# Altium schematic sheet Robot_Э3.SchDoc: Наименование
size 840 x 594 mm; SheetNumber: 1; SheetTotal: 1; PageSetup: Record=PageOptions|CenterHorizontal=True|CenterVertical=True|PrintScale=0.94|XCorrection=1.00|YCorrection=1.00|PrintKind=1|BorderSize=5000000|LeftOffset=0|BottomOffset=0|Orientation=1|PaperLength=1000|PaperWidth=1000|Scale=100|PaperSource=7|PrintQuality=-4|MediaType=1|DitherType=10|PaperKind=A4|PrintScaleMode=1; HeadOfSector: Нач. сектора; Name: Наименование; Type: Схема электрическая принципиальная; ListNumber: 1; DocumentName: Sheet1.SCHDOC
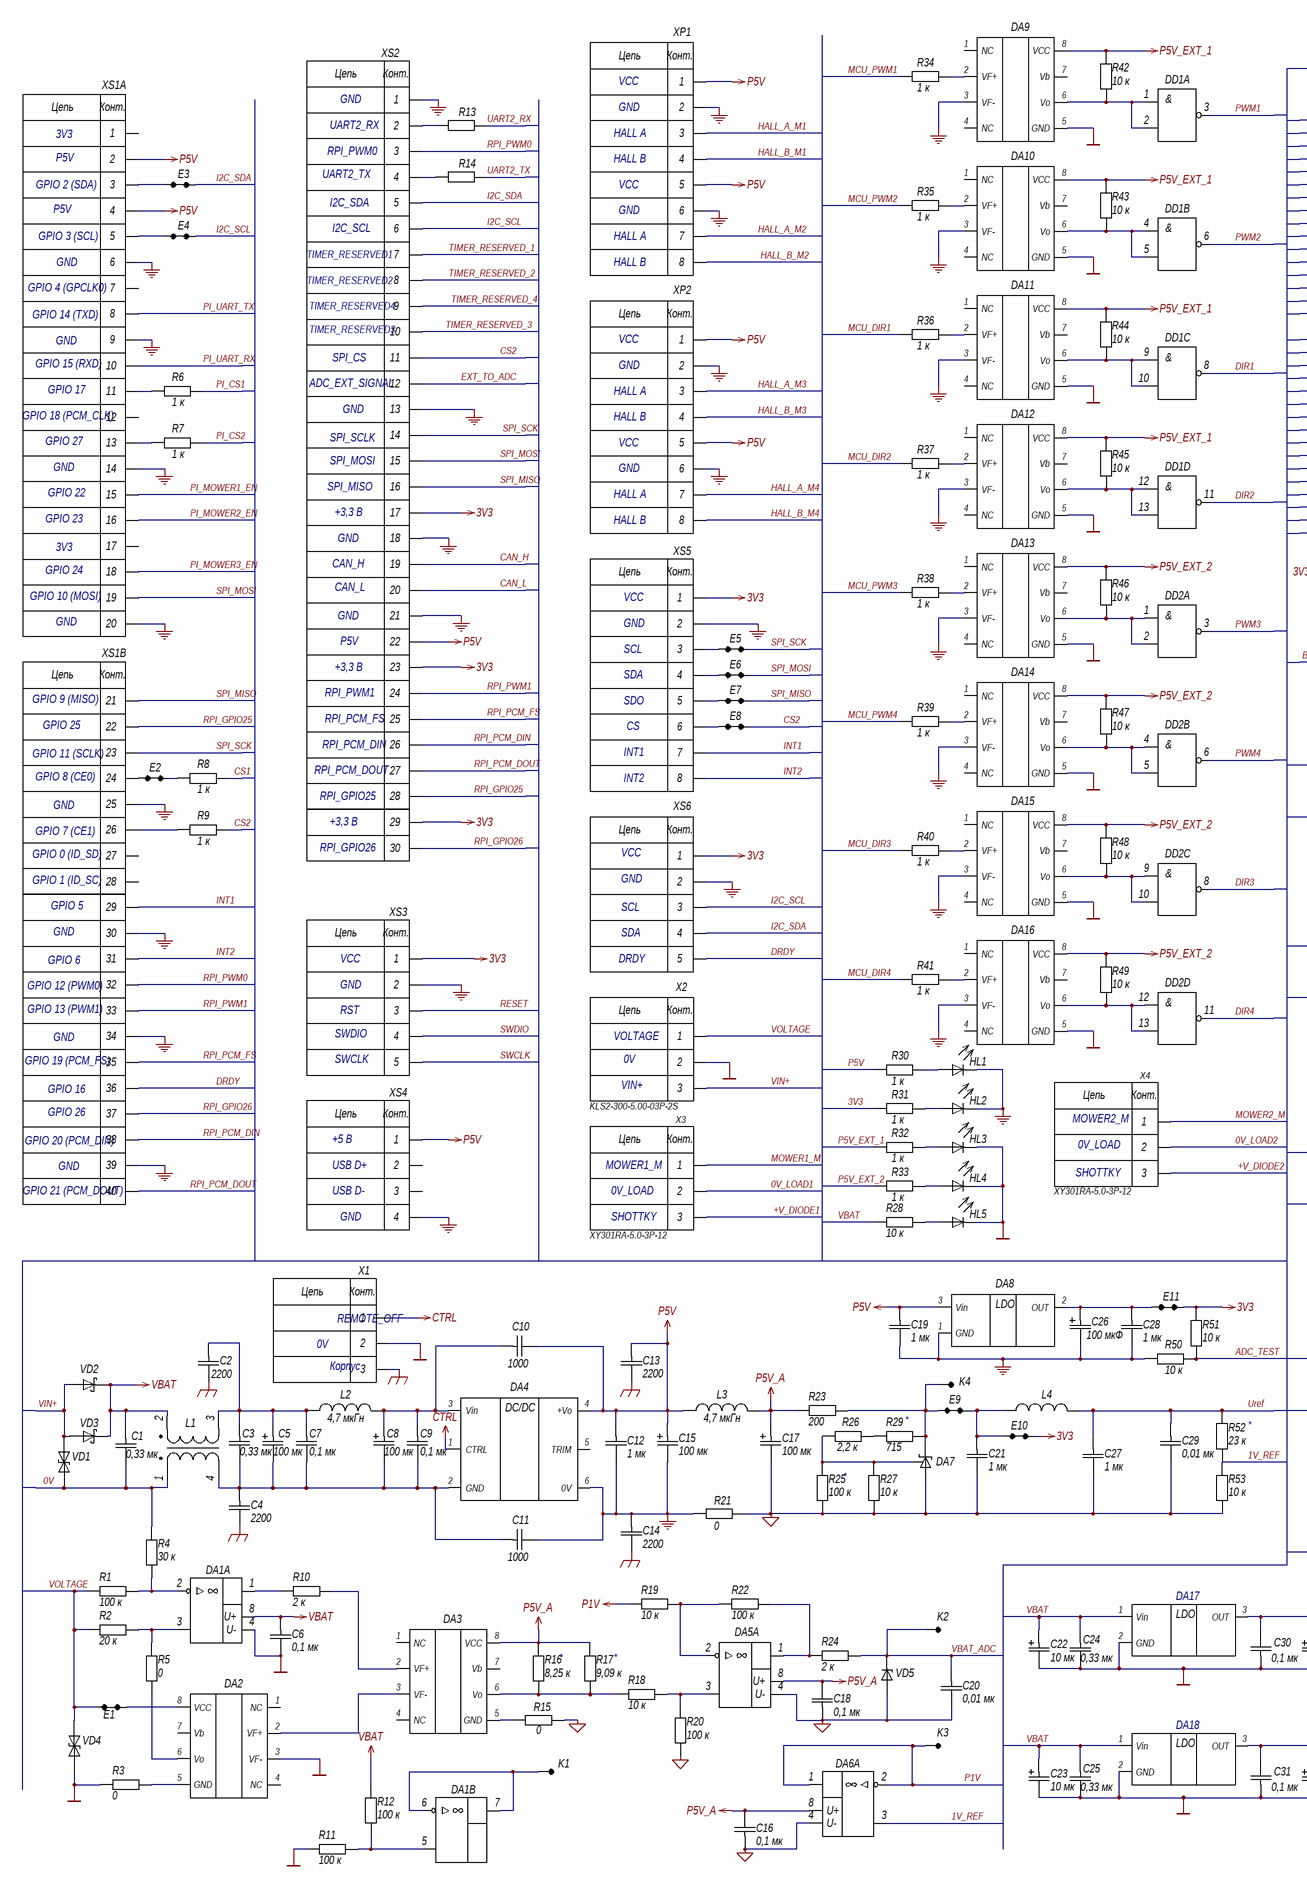
[diagram p0: Robot_Э3.SchDoc, left]
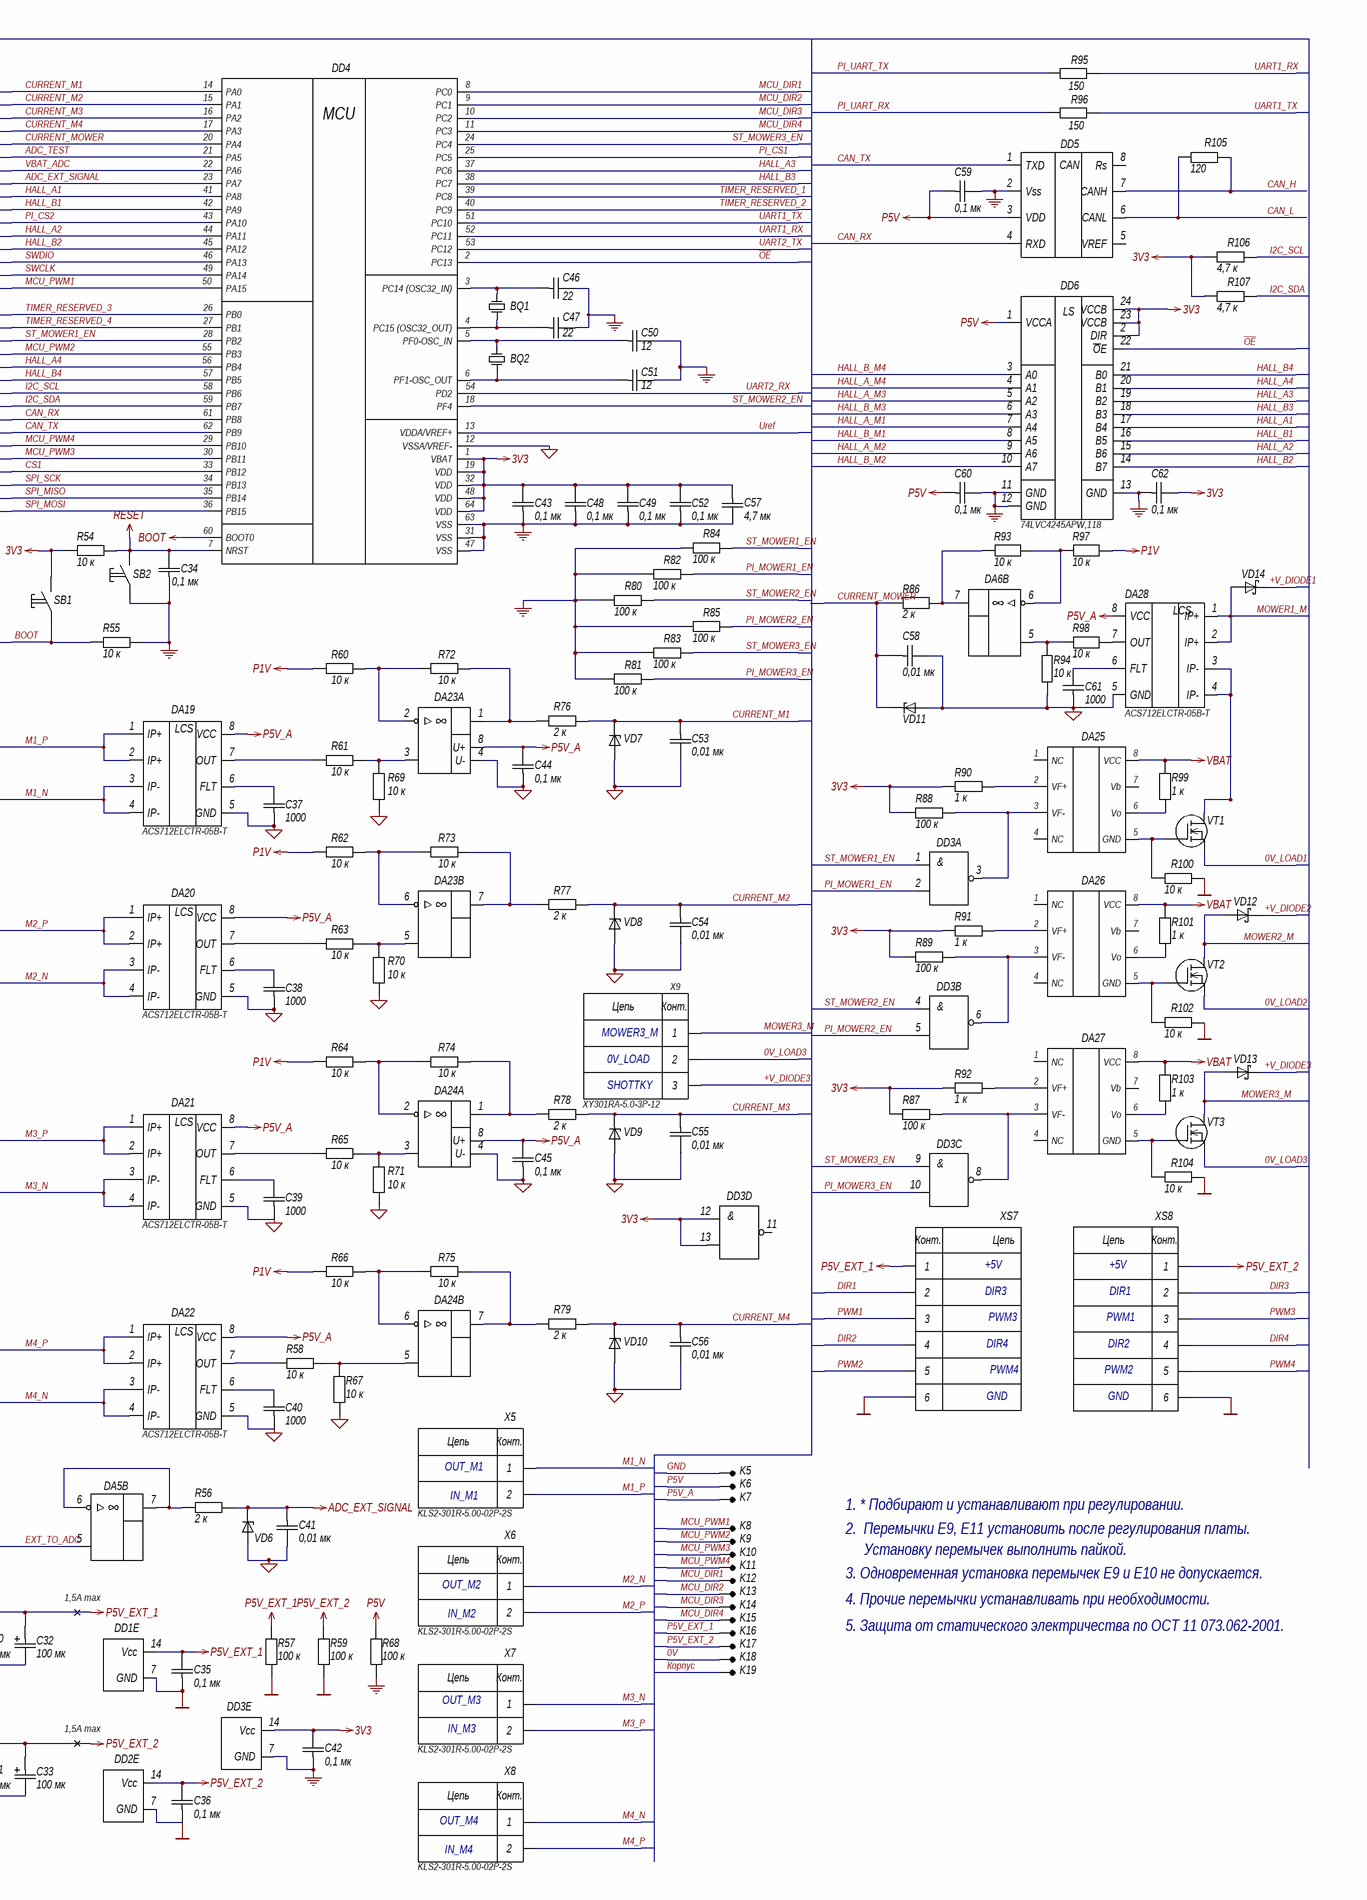
[diagram p1: Robot_Э3.SchDoc, right]

## Parts
BQ1  (no value)  [HC-49S]
BQ2  (no value)  [32768SMD]
C1  0,33 мк  [C1206]
C2  2200  [C1206]
C3  0,33 мк  [C1206]
C4  2200  [C1206]
C5  100 мк  [Capacitor10x20]
C6  0,1 мк  [C1206]
C7  0,1 мк  [C1206]
C8  100 мк  [Capacitor10x20]
C9  0,1 мк  [C1206]
C10  1000  [R1206]
C11  1000  [R1206]
C12  1 мк  [C0805]
C13  2200  [C1206]
C14  2200  [C1206]
C15  100 мк  [Case C]
C16  0,1 мк  [C1206]
C17  100 мк  [Case C]
C18  0,1 мк  [C1206]
C19  1 мк  [C0805]
C20  0,01 мк  [C0603]
C21  1 мк  [C0805]
C22  10 мк  [Case C]
C23  10 мк  [Case C]
C24  0,33 мк  [C1206]
C25  0,33 мк  [C1206]
C26  100 мкФ  [Case C]
C27  1 мк  [C0805]
C28  1 мк  [C0805]
C29  0,01 мк  [C0603]
C30  0,1 мк  [C1206]
C31  0,1 мк  [C1206]
C32  100 мк  [Case C]
C33  100 мк  [Case C]
C34  0,1 мк  [C1206]
C35  0,1 мк  [C1206]
C36  0,1 мк  [C1206]
C37  1000  [C1206]
C38  1000  [C1206]
C39  1000  [C1206]
C40  1000  [C1206]
C41  0,01 мк  [C0603]
C42  0,1 мк  [C1206]
C43  0,1 мк  [C1206]
C44  0,1 мк  [C1206]
C45  0,1 мк  [C1206]
C46  22  [C0603]
C47  22  [C0603]
C48  0,1 мк  [C1206]
C49  0,1 мк  [C1206]
C50  12  [C0603]
C51  12  [C0603]
C52  0,1 мк  [C1206]
C53  0,01 мк  [C0603]
C54  0,01 мк  [C0603]
C55  0,01 мк  [C0603]
C56  0,01 мк  [C0603]
C57  4,7 мк  [C1206]
C58  0,01 мк  [C0603]
C59  0,1 мк  [C1206]
C60  0,1 мк  [C1206]
C61  1000  [C1206]
C62  0,1 мк  [C1206]
DA1  LM358ADR  [SOIC-8]  (value not drawn)  (parts A,B of 2)
DA2  6N136  [6N136]  (value not drawn)
DA3  6N136  [6N136]  (value not drawn)
DA4  Part Number  [URB_LD-20WR3]  (value not drawn)
DA5  OPA-2-8p  [SOIC-8]  (value not drawn)  (parts A,B of 2)
DA6  OPA-2-8p  [SOIC-8]  (value not drawn)  (parts A,B of 2)
DA7  (no value)  [SOT-23-3]
DA8  (no value)  [SOT-223-3]
DA9  6N136  [6N136]  (value not drawn)
DA10  6N136  [6N136]  (value not drawn)
DA11  6N136  [6N136]  (value not drawn)
DA12  6N136  [6N136]  (value not drawn)
DA13  6N136  [6N136]  (value not drawn)
DA14  6N136  [6N136]  (value not drawn)
DA15  6N136  [6N136]  (value not drawn)
DA16  6N136  [6N136]  (value not drawn)
DA17  (no value)  [D2PAK(TO-263)]
DA18  (no value)  [D2PAK(TO-263)]
DA19  ACS712ELCTR-05B-T  [SOIC-8]
DA20  ACS712ELCTR-05B-T  [SOIC-8]
DA21  ACS712ELCTR-05B-T  [SOIC-8]
DA22  ACS712ELCTR-05B-T  [SOIC-8]
DA23  OPA-2-8p  [SOIC-8]  (value not drawn)  (parts A,B of 2)
DA24  OPA-2-8p  [SOIC-8]  (value not drawn)  (parts A,B of 2)
DA25  6N136  [6N136]  (value not drawn)
DA26  6N136  [6N136]  (value not drawn)
DA27  6N136  [6N136]  (value not drawn)
DA28  ACS712ELCTR-05B-T  [SOIC-8]
DD1  (no value)  [SOIC-14]  (parts A,B,C,D,E of 5)
DD2  (no value)  [SOIC-14]  (parts A,B,C,D,E of 5)
DD3  (no value)  [SOIC-14]  (parts A,B,C,D,E of 5)
DD4  Микроконтроллер  [TI TQFP-64 PAG0064A]  (value not drawn)
DD5  MCP2551  [SOIC-8]  (value not drawn)
DD6  74LVC4245APW,118  [TSSOP-24]
E1  (no value)  [E2]
E2  (no value)  [E2]
E3  (no value)  [E2]
E4  (no value)  [E2]
E5  (no value)  [E2]
E6  (no value)  [E2]
E7  (no value)  [E2]
E8  (no value)  [E2]
E9  (no value)  [E2]
E10  (no value)  [E2]
E11  (no value)  [E2]
HL1  KP-2012SURCK  [LED0805]  (value not drawn)
HL2  KP-2012SGC  [LED0805]  (value not drawn)
HL3  KP-2012SYCK  [LED0805]  (value not drawn)
HL4  KP-2012SYCK  [LED0805]  (value not drawn)
HL5  KP-2012SYCK  [LED0805]  (value not drawn)
K1  *  [E1(1mm)]  (value not drawn)
K2  *  [E1(1mm)]  (value not drawn)
K3  *  [E1(1mm)]  (value not drawn)
K4  *  [E1(1mm)]  (value not drawn)
K5  *  [E1(1mm)]  (value not drawn)
K6  *  [E1(1mm)]  (value not drawn)
K7  *  [E1(1mm)]  (value not drawn)
K8  *  [E1(1mm)]  (value not drawn)
K9  *  [E1(1mm)]  (value not drawn)
K10  *  [E1(1mm)]  (value not drawn)
K11  *  [E1(1mm)]  (value not drawn)
K12  *  [E1(1mm)]  (value not drawn)
K13  *  [E1(1mm)]  (value not drawn)
K14  *  [E1(1mm)]  (value not drawn)
K15  *  [E1(1mm)]  (value not drawn)
K16  *  [E1(1mm)]  (value not drawn)
K17  *  [E1(1mm)]  (value not drawn)
K18  *  [E1(1mm)]  (value not drawn)
K19  *  [E1(1mm)]  (value not drawn)
L1  (no value)  [ACM7060-701-2PL-TL01]
L2  4,7 мкГн  [B82472G6472M000]
L3  4,7 мкГн  [B82472G6472M000]
L4  18 мГн  [R0603]  (value not drawn)
R1  100 к  [R1206]
R2  20 к  [С2-29В]
R3  0  [R1206]
R4  30 к  [R1206]
R5  0  [R1206]
R6  1 к  [R1206]
R7  1 к  [R1206]
R8  1 к  [R1206]
R9  1 к  [R1206]
R10  2 к  [R1206]
R11  100 к  [R1206]
R12  100 к  [R1206]
R13  150  [R1206]  (value not drawn)
R14  150  [R1206]  (value not drawn)
R15  0  [R1206]
R16  8,25 к  [С2-29В]
R17  9,09 к  [С2-29В]
R18  10 к  [R1206]
R19  10 к  [R1206]
R20  100 к  [R1206]
R21  0  [R1206]
R22  100 к  [R1206]
R23  200  [R1206]
R24  2 к  [R1206]
R25  100 к  [С2-29В]
R26  2,2 к  [R1206]
R27  10 к  [R1206]
R28  10 к  [R1206]
R29  715  [С2-29В]
R30  1 к  [R1206]
R31  1 к  [R1206]
R32  1 к  [R1206]
R33  1 к  [R1206]
R34  1 к  [R1206]
R35  1 к  [R1206]
R36  1 к  [R1206]
R37  1 к  [R1206]
R38  1 к  [R1206]
R39  1 к  [R1206]
R40  1 к  [R1206]
R41  1 к  [R1206]
R42  10 к  [R1206]
R43  10 к  [R1206]
R44  10 к  [R1206]
R45  10 к  [R1206]
R46  10 к  [R1206]
R47  10 к  [R1206]
R48  10 к  [R1206]
R49  10 к  [R1206]
R50  10 к  [R1206]
R51  10 к  [R1206]
R52  23 к  [С2-29В]
R53  10 к  [R1206]
R54  10 к  [R1206]
R55  10 к  [R1206]
R56  2 к  [R1206]
R57  100 к  [R1206]
R58  10 к  [R1206]
R59  100 к  [R1206]
R60  10 к  [R1206]
R61  10 к  [R1206]
R62  10 к  [R1206]
R63  10 к  [R1206]
R64  10 к  [R1206]
R65  10 к  [R1206]
R66  10 к  [R1206]
R67  10 к  [R1206]
R68  100 к  [R1206]
R69  10 к  [R1206]
R70  10 к  [R1206]
R71  10 к  [R1206]
R72  10 к  [R1206]
R73  10 к  [R1206]
R74  10 к  [R1206]
R75  10 к  [R1206]
R76  2 к  [R1206]
R77  2 к  [R1206]
R78  2 к  [R1206]
R79  2 к  [R1206]
R80  100 к  [R1206]
R81  100 к  [R1206]
R82  100 к  [R1206]
R83  100 к  [R1206]
R84  100 к  [R1206]
R85  100 к  [R1206]
R86  2 к  [R1206]
R87  100 к  [R1206]
R88  100 к  [R1206]
R89  100 к  [R1206]
R90  1 к  [R1206]
R91  1 к  [R1206]
R92  1 к  [R1206]
R93  10 к  [R1206]
R94  10 к  [R1206]
R95  150  [R1206]
R96  150  [R1206]
R97  10 к  [R1206]
R98  10 к  [R1206]
R99  1 к  [R1206]
R100  10 к  [R1206]
R101  1 к  [R1206]
R102  10 к  [R1206]
R103  1 к  [R1206]
R104  10 к  [R1206]
R105  120  [С2-29В]
R106  4,7 к  [R0805]
R107  4,7 к  [R0805]
SB1  (no value)  [KLS7-TS6601-7.0-180]
SB2  (no value)  [KLS7-TS6601-7.0-180]
VD1  SM6T36CA  [DO-214AA]  (value not drawn)
VD2  (no value)  [B340A]
VD3  (no value)  [B340A]
VD4  SM6T36CA  [DO-214AA]  (value not drawn)
VD5  Suppressor  [SOT-23-3]  (value not drawn)
VD6  Suppressor  [SOT-23-3]  (value not drawn)
VD7  Suppressor  [SOT-23-3]  (value not drawn)
VD8  Suppressor  [SOT-23-3]  (value not drawn)
VD9  Suppressor  [SOT-23-3]  (value not drawn)
VD10  Suppressor  [SOT-23-3]  (value not drawn)
VD11  Suppressor  [SOT-23-3]  (value not drawn)
VD12  (no value)  [B340A]
VD13  (no value)  [B340A]
VD14  (no value)  [B340A]
VT1  IRFR024NTR  [DPAK]  (value not drawn)
VT2  IRFR024NTR  [DPAK]  (value not drawn)
VT3  IRFR024NTR  [DPAK]  (value not drawn)
X1  KLS2-300-5.00-03P-2S  [KLS2-300-5.00-03P-2S]  (value not drawn)
X2  KLS2-300-5.00-03P-2S  [KLS2-300-5.00-03P-2S]
X3  XY301RA-5.0-3P-12  [XY301RA-5.0-3P-12]
X4  XY301RA-5.0-3P-12  [XY301RA-5.0-3P-12]
X5  KLS2-301R-5.00-02P-2S  [KLS2-301R-5.00-02P-2S]
X6  KLS2-301R-5.00-02P-2S  [KLS2-301R-5.00-02P-2S]
X7  KLS2-301R-5.00-02P-2S  [KLS2-301R-5.00-02P-2S]
X8  KLS2-301R-5.00-02P-2S  [KLS2-301R-5.00-02P-2S]
X9  XY301RA-5.0-3P-12  [XY301RA-5.0-3P-12]
XP1  IDC-08MR  [SAMTEC_TST-104-04-T-D-RA]  (value not drawn)
XP2  IDC-08MR  [SAMTEC_TST-104-04-T-D-RA]  (value not drawn)
XS1  PBD-40  [RPI4B - duplicate]  (value not drawn)  (parts A,B of 2)
XS2  PBD-30  [PBD-32R]  (value not drawn)
XS3  PBS-5  [PBS-5]  (value not drawn)
XS4  PBS-4  [type-c]  (value not drawn)
XS5  PBS-8  [PBS-8]  (value not drawn)
XS6  PBS-5  [PBS-5]  (value not drawn)
XS7  CON-6F driver  [driver]  (value not drawn)
XS8  CON-6F driver  [driver]  (value not drawn)

## Nets
0V: C1.2 C6.2 C22.n C23.n C24.2 C25.2 C30.1 C31.1 C32.n C33.n C35.1 C36.1 DA1.4(U-) DA2.3(VF-) DA9.5(GND) DA10.5(GND) DA11.5(GND) DA12.5(GND) DA13.5(GND) DA14.5(GND) DA15.5(GND) DA16.5(GND) DA17.2(GND) DA18.2(GND) DD1.7(GND) DD2.7(GND) HL3.c(C) HL4.c(C) HL5.c(C) K18.1 L1.1 R3.1 R4.2 R11.2 R57.1 R59.1 R100.1 R102.1 R104.1 VD1.2 VD4.2 X1.2 X2.2 XS7.6 XS8.6
3V3: C42.2 C43.2 C48.2 C49.2 C52.2 C57.1 C62.2 DD3.12(A4) DD3.13(B4) DD3.14(Vcc) DD4.1(VBAT) DD4.19(VDD) DD4.32(VDD) DD4.48(VDD) DD4.64(VDD) DD6.2(DIR) DD6.23(VCCB) DD6.24(VCCB) E10.2 E11.1 R31.1 R51.2 R54.1 R87.2 R88.2 R89.2 R90.2 R91.2 R92.2 R106.1 R107.1 SB1.2 XS2.17 XS2.23 XS2.29 XS3.1 XS5.1 XS6.1
ADC_EXT_SIGNAL: C41.1 DD4.23(PA7) R56.2 VD6.3(C)
AGND: C16.1 C17.n C18.1 C20.2 C21.2 C27.2 C29.2 C37.1 C38.1 C39.1 C40.1 C41.2 C44.1 C45.1 C53.2 C54.2 C55.2 C56.2 C58.2 C61.1 DA5.4(U-) DA6.4(U-) DA7.3(A) DA19.5(GND) DA20.5(GND) DA21.5(GND) DA22.5(GND) DA23.4(U-) DA24.4(U-) DA28.5(GND) DD4.12(VSSA/VREF-) R15.2 R20.1 R21.2 R25.1 R27.1 R53.1 R67.2 R69.2 R70.2 R71.2 R94.2 VD5.1(A) VD6.1(A) VD7.1(A) VD8.1(A) VD9.1(A) VD10.1(A) VD11.1(A)
BOOT: DD4.60(BOOT0) R55.2 SB1.1
CTRL: DA4.1(CTRL) X1.1
GND: C11.2 C12.2 C14.1 C15.n C19.2 C26.n C28.2 C34.1 C42.1 C43.1 C46.2 C47.2 C48.1 C49.1 C50.2 C51.2 C52.1 C57.2 C59.2 C60.2 C62.1 DA4.6(0V) DA8.1(GND) DA9.3(VF-) DA10.3(VF-) DA11.3(VF-) DA12.3(VF-) DA13.3(VF-) DA14.3(VF-) DA15.3(VF-) DA16.3(VF-) DD3.7(GND) DD4.31(VSS) DD4.47(VSS) DD4.63(VSS) DD5.2(Vss) DD6.11(GND) DD6.12(GND) DD6.13(GND) HL1.c(C) HL2.c(C) K5.1 R21.1 R50.2 R55.1 R68.1 R80.2 R81.2 R82.2 R83.2 R84.2 R85.2 SB2.1 XP1.2 XP1.6 XP2.2 XP2.6 XS1.6 XS1.9 XS1.14 XS1.20 XS1.25 XS1.30 XS1.34 XS1.39 XS2.1 XS2.13 XS2.18 XS2.21 XS3.2 XS4.4 XS5.2 XS6.2
P1V: DA6.1(OUT) DA6.2(IN-) K3.1 R19.1 R60.1 R62.1 R64.1 R66.1 R97.1
P5V: C10.2 C12.1 C13.1 C15.p C19.1 C59.1 C60.1 DA4.4(+Vo) DA8.3(Vin) DD5.3(VDD) DD6.1(VCCA) K6.1 L3.1 R30.1 R68.2 XP1.1 XP1.5 XP2.1 XP2.5 XS1.2 XS1.4 XS2.22 XS4.1
P5V_A: C16.2 C17.p C18.2 C44.2 C45.2 DA3.8(VCC) DA5.8(U+) DA6.8(U+) DA19.8(VCC) DA20.8(VCC) DA21.8(VCC) DA22.8(VCC) DA23.8(U+) DA24.8(U+) DA28.8(VCC) K7.1 L3.2 R16.2 R17.2 R23.1
P5V_EXT_1: C30.2 C32.p C35.2 DA9.8(VCC) DA10.8(VCC) DA11.8(VCC) DA12.8(VCC) DA17.3(OUT) DD1.14(Vcc) K16.1 R32.1 R42.2 R43.2 R44.2 R45.2 R57.2 XS7.1
P5V_EXT_2: C31.2 C33.p C36.2 DA13.8(VCC) DA14.8(VCC) DA15.8(VCC) DA16.8(VCC) DA18.3(OUT) DD2.14(Vcc) K17.1 R33.1 R46.2 R47.2 R48.2 R49.2 R59.2 XS8.1
RESET: C34.2 DD4.7(NRST) R54.2 SB2.2 XS3.3
VBAT: C1.1 C6.1 C22.p C23.p C24.1 C25.1 DA1.8(U+) DA17.1(Vin) DA18.1(Vin) DA25.8(VCC) DA26.8(VCC) DA27.8(VCC) L1.2 R12.1 R28.1 R99.2 R101.2 R103.2 VD2.C VD3.C
Корпус: C2.2 C4.2 C13.2 C14.2 K19.1 X1.3
0V_LOAD1: VT1.3(S) X3.2
0V_LOAD2: VT2.3(S) X4.2
0V_LOAD3: VT3.3(S) X9.2
1V_REF: DA6.3(IN+) R52.1 R53.2
+V_DIODE1: VD14.C X3.3
+V_DIODE2: VD12.C X4.3
+V_DIODE3: VD13.C X9.3
ADC_TEST: DD4.21(PA5) R50.1 R51.1
CAN_H: DD5.7(CANH) R105.2 XS2.19
CAN_L: DD5.6(CANL) R105.1 XS2.20
CAN_RX: DD4.61(PB8) DD5.4(RXD)
CAN_TX: DD4.62(PB9) DD5.1(TXD)
CS1: DD4.33(PB12) R8.1
CS2: E8.2 R9.1 XS2.11
CURRENT_M1: C53.1 DD4.14(PA0) R76.2 VD7.3(C)
CURRENT_M2: C54.1 DD4.15(PA1) R77.2 VD8.3(C)
CURRENT_M3: C55.1 DD4.16(PA2) R78.2 VD9.3(C)
CURRENT_M4: C56.1 DD4.17(PA3) R79.2 VD10.3(C)
CURRENT_MOWER: C58.1 DD4.20(PA4) R86.2 VD11.3(C)
DIR1: DD1.8(Y3) XS7.2
DIR2: DD1.11(Y4) XS7.4
DIR3: DD2.8(Y3) XS8.2
DIR4: DD2.11(Y4) XS8.4
DRDY: XS1.36 XS6.5
EXT_TO_ADC: DA5.5(IN+) XS2.12
HALL_A1: DD4.41(PA8) DD6.17(B4)
HALL_A2: DD4.44(PA11) DD6.15(B6)
HALL_A3: DD4.37(PC6) DD6.19(B2)
HALL_A4: DD4.56(PB4) DD6.20(B1)
HALL_A_M1: DD6.7(A4) XP1.3
HALL_A_M2: DD6.9(A6) XP1.7
HALL_A_M3: DD6.5(A2) XP2.3
HALL_A_M4: DD6.4(A1) XP2.7
HALL_B1: DD4.42(PA9) DD6.16(B5)
HALL_B2: DD4.45(PA12) DD6.14(B7)
HALL_B3: DD4.38(PC7) DD6.18(B3)
HALL_B4: DD4.57(PB5) DD6.21(B0)
HALL_B_M1: DD6.8(A5) XP1.4
HALL_B_M2: DD6.10(A7) XP1.8
HALL_B_M3: DD6.6(A3) XP2.4
HALL_B_M4: DD6.3(A0) XP2.8
I2C_SCL: DD4.58(PB6) E4.2 R106.2 XS2.6 XS6.3
I2C_SDA: DD4.59(PB7) E3.2 R107.2 XS2.5 XS6.4
INT1: XS1.29 XS5.7
INT2: XS1.31 XS5.8
M1_N: DA19.3(IP-) DA19.4(IP-) X5.1
M1_P: DA19.1(IP+) DA19.2(IP+) X5.2
M2_N: DA20.3(IP-) DA20.4(IP-) X6.1
M2_P: DA20.1(IP+) DA20.2(IP+) X6.2
M3_N: DA21.3(IP-) DA21.4(IP-) X7.1
M3_P: DA21.1(IP+) DA21.2(IP+) X7.2
M4_N: DA22.3(IP-) DA22.4(IP-) X8.1
M4_P: DA22.1(IP+) DA22.2(IP+) X8.2
MCU_DIR1: DD4.8(PC0) K12.1 R36.1
MCU_DIR2: DD4.9(PC1) K13.1 R37.2
MCU_DIR3: DD4.10(PC2) K14.1 R40.1
MCU_DIR4: DD4.11(PC3) K15.1 R41.2
MCU_PWM1: DD4.50(PA15) K8.1 R34.1
MCU_PWM2: DD4.55(PB3) K9.1 R35.1
MCU_PWM3: DD4.30(PB11) K10.1 R38.1
MCU_PWM4: DD4.29(PB10) K11.1 R39.1
MOWER1_M: DA28.1(IP+) DA28.2(IP+) VD14.A X3.1
MOWER2_M: VD12.A VT2.2(D) X4.1
MOWER3_M: VD13.A VT3.2(D) X9.1
~{OE}: DD4.2(PC13) DD6.22(~{O}E)
PI_CS1: DD4.25(PC5) R6.1
PI_CS2: DD4.43(PA10) R7.1
PI_MOWER1_EN: DD3.2(B1) R82.1 XS1.15
PI_MOWER2_EN: DD3.5(B2) R85.1 XS1.16
PI_MOWER3_EN: DD3.10(B3) R81.1 XS1.18
PI_UART_RX: R96.1 XS1.10
PI_UART_TX: R95.1 XS1.8
PWM1: DD1.3(Y1) XS7.3
PWM2: DD1.6(Y2) XS7.5
PWM3: DD2.3(Y1) XS8.3
PWM4: DD2.6(Y2) XS8.5
RPI_GPIO25: XS1.22 XS2.28
RPI_GPIO26: XS1.37 XS2.30
RPI_PCM_DIN: XS1.38 XS2.26
RPI_PCM_DOUT: XS1.40 XS2.27
RPI_PCM_FS: XS1.35 XS2.25
RPI_PWM0: XS1.32 XS2.3
RPI_PWM1: XS1.33 XS2.24
SPI_MISO: DD4.35(PB14) E7.2 XS1.21 XS2.16
SPI_MOSI: DD4.36(PB15) E6.2 XS1.19 XS2.15
SPI_SCK: DD4.34(PB13) E5.2 XS1.23 XS2.14
ST_MOWER1_EN: DD3.1(A1) DD4.28(PB2) R84.1
ST_MOWER2_EN: DD3.4(A2) DD4.18(PF4) R80.1
ST_MOWER3_EN: DD3.9(A3) DD4.24(PC4) R83.1
SWCLK: DD4.49(PA14) XS3.5
SWDIO: DD4.46(PA13) XS3.4
TIMER_RESERVED_1: DD4.39(PC8) XS2.7
TIMER_RESERVED_2: DD4.40(PC9) XS2.8
TIMER_RESERVED_3: DD4.26(PB0) XS2.10
TIMER_RESERVED_4: DD4.27(PB1) XS2.9
UART1_RX: DD4.52(PC11) R95.2
UART1_TX: DD4.51(PC10) R96.2
UART2_RX: DD4.54(PD2) R13.2
UART2_TX: DD4.53(PC12) R14.2
Uref: C27.1 C29.1 DD4.13(VDDA/VREF+) L4.2 R52.2
VBAT_ADC: C20.1 DD4.22(PA6) K2.1 R24.2 VD5.3(C)
VIN+: VD1.1 VD2.A VD3.A X2.3
VOLTAGE: E1.2 R1.2 R2.1 VD4.1 X2.1
NetBQ1_1: BQ1.1 C47.1 DD4.4(PC15_(OSC32_OUT))
NetBQ1_3: BQ1.3 C46.1 DD4.3(PC14_(OSC32_IN))
NetBQ2_1: BQ2.1 C51.1 DD4.6(PF1-OSC_OUT)
NetBQ2_2: BQ2.2 C50.1 DD4.5(PF0-OSC_IN)
NetC2_1: C2.1 C3.1 C5.p C7.1 L1.3 L2.1
NetC3_2: C3.2 C4.1 C5.n C7.2 C8.n C9.2 C11.1 DA4.2(GND) L1.4
NetC8_p: C8.p C9.1 C10.1 DA4.3(Vin) L2.2
NetC21_1: C21.1 E9.2 E10.1 L4.1
NetC26_p: C26.p C28.1 DA8.2(OUT) E11.2
NetC37_2: C37.2 DA19.6(FLT)
NetC38_2: C38.2 DA20.6(FLT)
NetC39_2: C39.2 DA21.6(FLT)
NetC40_2: C40.2 DA22.6(FLT)
NetC61_2: C61.2 DA28.6(FLT)
NetDA1_1: DA1.1(OUT) R10.1
NetDA1_2: DA1.2(IN-) R1.1 R4.1
NetDA1_3: DA1.3(IN+) R2.2 R5.1
NetDA1_5: DA1.5(IN+) R11.1 R12.2
NetDA1_6: DA1.6(IN-) DA1.7(OUT) K1.1
NetDA2_2: DA2.2(VF+) DA3.3(VF-)
NetDA2_5: DA2.5(GND) R3.2
NetDA2_6: DA2.6(Vo) R5.2
NetDA2_8: DA2.8(VCC) E1.1
NetDA3_2: DA3.2(VF+) R10.2
NetDA3_5: DA3.5(GND) R15.1
NetDA3_6: DA3.6(Vo) R16.1 R17.1 R18.1
NetDA5_1: DA5.1(OUT) R22.1 R24.1
NetDA5_2: DA5.2(IN-) R19.2 R22.2
NetDA5_3: DA5.3(IN+) R18.2 R20.2
NetDA5_6: DA5.6(IN-) DA5.7(OUT) R56.1
NetDA6_5: DA6.5(IN+) R94.1 R98.2
NetDA6_6: DA6.6(IN-) R93.1 R97.2
NetDA6_7: DA6.7(OUT) R86.1 R93.2
NetDA7_1: DA7.1(C) E9.1 K4.1 R23.2 R29.2
NetDA7_2: DA7.2(Ref) R25.2 R26.1 R27.2
NetDA9_2: DA9.2(VF+) R34.2
NetDA9_6: DA9.6(Vo) DD1.1(A1) DD1.2(B1) R42.1
NetDA10_2: DA10.2(VF+) R35.2
NetDA10_6: DA10.6(Vo) DD1.4(A2) DD1.5(B2) R43.1
NetDA11_2: DA11.2(VF+) R36.2
NetDA11_6: DA11.6(Vo) DD1.9(A3) DD1.10(B3) R44.1
NetDA12_2: DA12.2(VF+) R37.1
NetDA12_6: DA12.6(Vo) DD1.12(A4) DD1.13(B4) R45.1
NetDA13_2: DA13.2(VF+) R38.2
NetDA13_6: DA13.6(Vo) DD2.1(A1) DD2.2(B1) R46.1
NetDA14_2: DA14.2(VF+) R39.2
NetDA14_6: DA14.6(Vo) DD2.4(A2) DD2.5(B2) R47.1
NetDA15_2: DA15.2(VF+) R40.2
NetDA15_6: DA15.6(Vo) DD2.9(A3) DD2.10(B3) R48.1
NetDA16_2: DA16.2(VF+) R41.1
NetDA16_6: DA16.6(Vo) DD2.12(A4) DD2.13(B4) R49.1
NetDA19_7: DA19.7(OUT) R61.1
NetDA20_7: DA20.7(OUT) R63.1
NetDA21_7: DA21.7(OUT) R65.1
NetDA22_7: DA22.7(OUT) R58.1
NetDA23_1: DA23.1(OUT) R72.2 R76.1
NetDA23_2: DA23.2(IN-) R60.2 R72.1
NetDA23_3: DA23.3(IN+) R61.2 R69.1
NetDA23_5: DA23.5(IN+) R63.2 R70.1
NetDA23_6: DA23.6(IN-) R62.2 R73.1
NetDA23_7: DA23.7(OUT) R73.2 R77.1
NetDA24_1: DA24.1(OUT) R74.2 R78.1
NetDA24_2: DA24.2(IN-) R64.2 R74.1
NetDA24_3: DA24.3(IN+) R65.2 R71.1
NetDA24_5: DA24.5(IN+) R58.2 R67.1
NetDA24_6: DA24.6(IN-) R66.2 R75.1
NetDA24_7: DA24.7(OUT) R75.2 R79.1
NetDA25_2: DA25.2(VF+) R90.1
NetDA25_3: DA25.3(VF-) DD3.3(Y1) R88.1
NetDA25_5: DA25.5(GND) R100.2 VT1.1(G)
NetDA25_6: DA25.6(Vo) R99.1
NetDA26_2: DA26.2(VF+) R91.1
NetDA26_3: DA26.3(VF-) DD3.6(Y2) R89.1
NetDA26_5: DA26.5(GND) R102.2 VT2.1(G)
NetDA26_6: DA26.6(Vo) R101.1
NetDA27_2: DA27.2(VF+) R92.1
NetDA27_3: DA27.3(VF-) DD3.8(Y3) R87.1
NetDA27_5: DA27.5(GND) R104.2 VT3.1(G)
NetDA27_6: DA27.6(Vo) R103.1
NetDA28_3: DA28.3(IP-) DA28.4(IP-) VT1.2(D)
NetDA28_7: DA28.7(OUT) R98.1
NetE2_1: E2.1 XS1.24
NetE2_2: E2.2 R8.2
NetE3_1: E3.1 XS1.3
NetE4_1: E4.1 XS1.5
NetE5_1: E5.1 XS5.3
NetE6_1: E6.1 XS5.4
NetE7_1: E7.1 XS5.5
NetE8_1: E8.1 XS5.6
NetHL1_a: HL1.a(A) R30.2
NetHL2_a: HL2.a(A) R31.2
NetHL3_a: HL3.a(A) R32.2
NetHL4_a: HL4.a(A) R33.2
NetHL5_a: HL5.a(A) R28.2
NetR6_2: R6.2 XS1.11
NetR7_2: R7.2 XS1.13
NetR9_2: R9.2 XS1.26
NetR13_1: R13.1 XS2.2
NetR14_1: R14.1 XS2.4
NetR26_2: R26.2 R29.1

Not connected (* = marked no-connect by the designer): DA2 1(NC) 4(NC) 7(Vb); DA3 1(NC) 4(NC) 7(Vb); DA4 5(TRIM); DA9 1(NC) 4(NC) 7(Vb); DA10 1(NC) 4(NC) 7(Vb); DA11 1(NC) 4(NC) 7(Vb); DA12 1(NC) 4(NC) 7(Vb); DA13 1(NC) 4(NC) 7(Vb); DA14 1(NC) 4(NC) 7(Vb); DA15 1(NC) 4(NC) 7(Vb); DA16 1(NC) 4(NC) 7(Vb); DA25 1(NC) 4(NC) 7(Vb); DA26 1(NC) 4(NC) 7(Vb); DA27 1(NC) 4(NC) 7(Vb); DD3 11(Y4); DD5 5(VREF) 8(Rs); VD5 2(NC); VD6 2(NC); VD7 2(NC); VD8 2(NC); VD9 2(NC); VD10 2(NC); VD11 2(NC); XS1 1 7 12 17 27 28; XS4 2 3

## Notes on the sheet
- GND
- VCC
- 3V3
- RPI_PWM0
- UART2_RX
- HALL A
- (near XS1) GPIO 2 (SDA)
- P5V
- UART2_TX
- HALL B
- I2C_SDA
- I2C_SCL
- (near XS1) GPIO 3 (SCL)
- (near XS2) TIMER_RESERVED1
- (near XS1) GPIO 4 (GPCLK0)
- (near XS1) GPIO 14 (TXD)
- (near XS2) TIMER_RESERVED2
- (near XS2) TIMER_RESERVED4
- (near XS2) TIMER_RESERVED3
- (near XS1) GPIO 15 (RXD)
- GPIO 17
- (near XS2) ADC_EXT_SIGNAL
- SPI_CS
- (near XS1) GPIO 18 (PCM_CLK)
- SPI_SCLK
- GPIO 27
- SPI_MOSI
- GPIO 23
- GPIO 22
- SPI_MISO
- +3,3 В
- (near XS1) GPIO 10 (MOSI)
- GPIO 24
- CAN_H
- CAN_L
- SCL
- SDA
- (near XS1) GPIO 9 (MISO)
- GPIO 25
- RPI_PWM1
- (near XS2) RPI_PCM_FS
- SDO
- (near XS1) GPIO 11 (SCLK)
- (near XS2) RPI_PCM_DIN
- INT1
- CS
- (near XS1) GPIO 8 (CE0)
- (near XS2) RPI_PCM_DOUT
- (near XS2) RPI_GPIO25
- INT2
- (near XS1) GPIO 7 (CE1)
- (near XS2) RPI_GPIO26
- (near XS1) GPIO 0 (ID_SD)
- (near XS1) GPIO 1 (ID_SC)
- GPIO 5
- GPIO 6
- DRDY
- (near XS1) GPIO 12 (PWM0)
- (near XS1) GPIO 13 (PWM1)
- RST
- SWDIO
- VOLTAGE
- MOWER3_M
- (near XS1) GPIO 19 (PCM_FS)
- GPIO 16
- SWCLK
- VIN+
- 0V
- 0V_LOAD
- GPIO 26
- MOWER2_M
- SHOTTKY
- (near XS1) GPIO 20 (PCM_DIN)
- +5 В
- USB D+
- MOWER1_M
- (near XS1) GPIO 21 (PCM_DOUT)
- USB D-
- +5V
- REMOTE_OFF
- DIR3
- PWM3
- PWM1
- DIR1
- Корпус
- DIR4
- PWM4
- PWM2
- DIR2
- (near R29) *
- (near R52) *
- *
- OUT_M1
- IN_M1
- 1. * Подбирают и устанавливают при регулировании.
- 2.  Перемычки Е9, Е11 установить после регулирования платы.
- 3. Одновременная установка перемычек Е9 и Е10 не допускается.
- Установку перемычек выполнить пайкой.
- 1,5A max
- OUT_M2
- IN_M2
- 4. Прочие перемычки устанавливать при необходимости.
- 5. Защита от статического электричества по ОСТ 11 073.062-2001.
- OUT_M3
- IN_M3
- OUT_M4
- IN_M4
- Перв. примен.
- Справ. №
- Подп. и дата
- Инв. № дубл.
- Взам. инв. №
- Изм.
- Лист
- № докум.
- Подп.
- Дата
- Лит.
- Масса
- Масштаб
- Разраб.
- Пров.
- Т. контр.
- Листов
- Инв. № подл.
- Н. контр.
- Утв.
- Копировал
- Формат А1
- (in symbol 74LVC4245APW,118) LS
- (in symbol ACS712ELCTR-05B-T) LCS
- (in symbol AMS1117-3.3) LDO
- (in symbol CON-6F driver) Цепь; Конт.
- (in symbol DC-DC URB2405LD-20WR3) DC/DC
- (in symbol IDC-08MR) Цепь; Конт.
- (in symbol KLS2-300-5.00-03P-2S) Цепь; Конт.
- (in symbol KLS2-301R-5.00-02P-2S) Цепь; Конт.
- (in symbol L7805ACD2T-TR) LDO
- (in symbol MCP2551) CAN
- (in symbol PBD-30) Цепь; Конт.
- (in symbol PBD-40, part A) Цепь; Конт.
- (in symbol PBD-40, part B) Цепь; Конт.
- (in symbol PBS-4) Цепь; Конт.
- (in symbol PBS-5) Цепь; Конт.
- (in symbol PBS-8) Цепь; Конт.
- (in symbol SN74HC00D, part A) &
- (in symbol SN74HC00D, part B) &
- (in symbol SN74HC00D, part C) &
- (in symbol SN74HC00D, part D) &
- (in symbol STM32F303RBT6) MCU
- (in symbol XY301RA-5.0-3P-12) Цепь; Конт.

## Library data of the parts
BQ1 = HC-49S_8MHZ: Part Number: 8.000MHzHC-49US; Manufacturer: Китай; Article: 297062262; Type: Резонатор кварцевый; Price: 38
BQ2 = 32768hz: Кварцевый резонатор; Manufacturer: Китай; Article: 9000372611; Type: Резонатор кварцевый; Part Number: 32768hz; Price: 98
C1 C3 C24 C25 = C1206C334K1RECAUTO7210: Конденсатор 0,33 мкФ 100 В; Manufacturer: Kemet; Article: 8005311007; Voltage: 100 В; Type: Конденсатор; Part Number: C1206C334K1RECAUTO7210; Value: 0,33 мк; Price: 88; Footprint: 1206
C2 C4 C13 C14 = TCC1206X7R222J102DT: Конденсатор 2200 пФ 1000 В; Manufacturer: CCTC; Article: 9001208170; Voltage: 1000 В; Type: Конденсатор; Part Number: TCC1206X7R222J102DT; Value: 2200; Price: 2; Footprint: 1206
C5 C8 = JRB2A101M05001000200000B: Конденсатор электролитический алюминиевый; Manufacturer: JB Capactiors; Article: 9000565887; Type: Конденсатор; Part Number: JRB2A101M05001000200000B; Price: 24; Value: 100 мк
C6 C7 C9 C16 C18 C30 C31 C34-C36 C42-C45 C48 C49 C52 C59 C60 C62 = 0.1 мкФ Х7R 100В 10% 1206: Конденсатор 0,1 мкФ 100 В; Manufacturer: Китай; Voltage: 1 кВ; Type: Конденсатор; Part Number: 0.1 мкФ Х7R 100В 10% 1206; Value: 0,1 мк; Price: 6; Footprint: 1206
C10 C11 = GRM31BR73A102K: Конденсатор 1000пФ; Manufacturer: Murata; Article: 961638233; Voltage: 1 кВ; Type: Конденсатор; Part Number: GRM31BR73A102K; Value: 1000; Price: 24; Footprint: 1206
C12 C19 C21 C27 C28 = 1 мкФ X7R 16В 10% 0805: Конденсатор 1 мкФ 16 В; Manufacturer: Китай; Article: 768017701; Voltage: 16 В; Type: Конденсатор; Part Number: 1 мкФ X7R 16В 10% 0805; Value: 1 мк; Price: 9; Footprint: 0805
C15 C17 C32 C33 = TECAP100/10VC: Конденсатор танталовый 100 мкФ; Part Number: TECAP100/10VC, 10%; Manufacturer: TECAP; Article: 9000629231; Type: Конденсатор; Price: 39; Value: 100 мк
C20 C29 C41 C53-C56 C58 = 0.01 мкФ  X7R 50В 10% 0603: Конденсатор 0,01 мкФ 50 В; Manufacturer: Murata; Voltage: 50 В; Article: 238964796; Type: Конденсатор; Value: 0,01 мк; Part Number: 0.01 мкФ  X7R 50В 10% 0603; Footprint: 0603; Price: 7
C22 C23 = TECAP10/35VC: Конденсатор танталовый 10 мкФ; Part Number: TECAP10/35VC, 10%; Manufacturer: TECAP; Article: 9000629228; Voltage: 35 В; Type: Конденсатор; Price: 46; Value: 10 мк
C26 = TECAP100/10VC, 10%: Конденсатор танталовый 100 мкФ; Manufacturer: TECAP; Type: Конденсатор; Part Number: TECAP100/10VC, 10%; Price: 39; Value: 100 мкФ
C37-C40 C61 = 1000пФ X7R 50В 10% 1206: Конденсатор 1000пФ 50 В; Manufacturer: Китай; Article: 9000028006; Voltage: 50 В; Type: Конденсатор; Part Number: 1000пФ X7R 50В 10% 1206; Value: 1000; Price: 9; Footprint: 1206
C46 C47 = GRM1885C1H220JA01D: Конденсатор; Manufacturer: Murata; ID: 122; Voltage: 50В; Tolerance: ±5%; Dielectric Type: NP0; Application Category: 1; Working Temperature Min: -55°С; Working Temperature Max: +125°С; Type: Конденсатор; Value: 22; Part Number: GRM1885C1H220JA01D; Footprint: 0603; Partnumber: GRM1885C1H220JA01D
C50 C51 = GRM1885C1H120JA01D: Конденсатор; Manufacturer: Murata; ID: 121; Voltage: 50В; Tolerance: ±5%; Dielectric Type: NP0; Application Category: 1; Working Temperature Min: -55°С; Working Temperature Max: +125°С; Type: Конденсатор; Value: 12; Part Number: GRM1885C1H120JA01D; Footprint: 0603; Partnumber: GRM1885C1H120JA01D
C57 = C3216X7R1E475KT000N: Конденсатор 4,7 мкФ 25 В; Manufacturer: TDK; Article: 8017208948; Voltage: 25 В; Type: Конденсатор; Part Number: C3216X7R1E475KT000N; Value: 4,7 мк; Price: 22; Footprint: 1206
DA1 = LM358ADR: Операционный усилитель; Manufacturer: UMW; Article: 9001105975; Type: Микросхема; Part Number: LM358ADR; Price: 9; Package: SOP-8
DA2 DA3 DA9-DA16 DA25-DA27 = 6N136: Оптопара транзисторная; Manufacturer: UMW; Article: 9001106156; Type: Микросхема; Part Number: 6N136; Price: 36; Package: dip-8
DA4 = DC-DC URB2405LD-20WR3: DC/DC преобразователь; Part Number: Mornsun; Type: Модуль питания; Manufacturer: URB2405LD-20WR3; Price: 900
DA5 DA6 DA23 DA24 = LMV358IDR: ID: 45; Supply Operation: +2.7…5.5V; Supply Current: 210uA; Rail-to-Rail: +\+; Slew Rate: 1V/µs; Bandwidth: 1MHz; Application Category: 1; Type: Микросхема; Part Number: LMV358IDR; Value: LMV358IDR
DA7 = TL431IDBZR.215: Источник опорного напряжения; Manufacturer: Nexperia; ID: 1; Input Voltage: 36V; Output Current: 100mA; Tolerance: 2.0%; Reference voltage: 2495mV; Total Power Dissipation: 580mW; Reference current: 10mA; Working Temperature Min: -40°С; Working Temperature Max: +85°С; Functional Analog: AS431H; Article 1C: 0984668; Type: Микросхема; Part Number: TL431IDBZR.215; Value: TL431IDBZR.215; Application Category: 1
DA8 = AMS1117-3.3: Стабилизатор напряжения; Manufacturer: UMW; Max Current: 0.8A; Article: 9001169164; Type: Микросхема; Part Number: AMS1117-3.3; Price: 9; Package: SOT-223
DA17 DA18 = L7805ACD2T-TR: Стабилизатор напряжения; Manufacturer: STMicroelectronics; Max Current: 1.5A; Article: 9000076530; Type: Микросхема; Part Number: L7805ACD2T-TR; Price: 76; Package: D2PAK
DA19-DA22 DA28 = ACS712ELCTR-05B-T: Датчик тока; Manufacturer: Allegro Systems; Article: 8010447146; Part Number: ACS712ELCTR-05B-T; Price: 220; Package: SOIC-8
DD1-DD3 = SN74HC00D: SNx4HC00 Quadruple 2-Input NAND Gates; Manufacturer: Texas Instruments; ID: 18; Supply Operation: +2…6V; Supply Current: 20uA; High-level output current: -20mA; Input Voltage (max): 5.9V; Channels: 4; Low-level output current: 20mA; Response Time: 400nS; Polarity: Inverting; Output Voltage (max): Vcc; Application Category: 1; Working Temperature Min: -40°C; Working Temperature Max: +85°C; Article 1C: 0988355; Type: Микросхема; Part Number: SN74HC00D; Value: SN74HC00D; Function: NAND; Power dissipation (max): -
DD4 = STM32F303RBT6: Manufacturer: STMicroelectronics; Flash: 128KB; Core: Cortex®-M4; Operation frequency: 72MHz; Voltage range: 1.7 V to 3.6 V; I/O Lines: 87; Timers: 13; DAC: 2; Clock management: 4 to 32 MHz crystal oscillator; ADC: 4; Article: 9001089793; Type: Микроконтроллер; Price: 410; Operating temperature: -40°C to 85°C; Part Number: STM32F303RBT6
DD5 = MCP2551: Высокоскоростной CAN-Трансивер, 1Мб/с, 12В/24В, до 112 узлов; Part Number: MCP2551T-I/SN; Manufacturer: Microchip; Article: 9000071123; Type: Микросхема; Price: 160; Package: SO-8
DD6 = 74LVC4245APW,118: Преобразователь уровней 5В-3,3В; Manufacturer: Nexperia; Article: 9000002267; Part Number: 74LVC4245APW,118; Type: Микросхема; Price: 140; Package: TSSOP-24
E1-E11 = E: Перемычка; Type: Перемычка
HL1 = KP-2012SURCK: Manufacturer: Kingbright; Type: Индикатор единичный; ID: 23; Forward Voltage: 2.5V; Forward Current: 30mA; Power Dissipation: 75mW; Luminous Flux: 150; Color: Red; Leds: 1; Working Temperature Min: -40°С; Working Temperature Max: +85°С; Part Number: KP-2012SURCK; Value: KP-2012SURCK; Footprint: 0805; Application Category: 1; Article 1C: -
HL2 = KP-2012SGC: Manufacturer: Kingbright; Type: Индикатор единичный; ID: 21; Forward Voltage: 2.5V; Forward Current: 25mA; Power Dissipation: 62.5mW; Color: Green; Leds: 1; Working Temperature Min: -40°С; Working Temperature Max: +85°С; Article 1C: 062604; Part Number: KP-2012SGC; Value: KP-2012SGC; Footprint: 0805; Application Category: 1
HL3-HL5 = KP-2012SYCK: Manufacturer: Kingbright; Type: Индикатор единичный; ID: 22; Forward Voltage: 2.5V; Forward Current: 30mA; Power Dissipation: 75mW; Luminous Flux: 150; Color: Yellow; Leds: 1; Working Temperature Min: -40°С; Working Temperature Max: +85°С; Article 1C: 0961238; Part Number: KP-2012SYCK; Value: KP-2012SYCK; Footprint: 0805; Application Category: 1
K1-K19 = КТ: Контрольная точка; Type: Неразборное соединение; Manufacturer: *; ManufacturerPartNumber: *
L1 = ACM7060-701-2PL-TL01: Manufacturer: TDK; Type: Дроссель; Article: 9000322175; Part Number: ACM7060-701-2PL-TL01; Price: 340
L2 L3 = B82472G6472M000: Дроссель; Manufacturer: Epcos; Max Current: 2.5 A; Article: 9000504715; Type: Дроссель; Part Number: B82472G6472M000; Value: 4,7 мкГн
L4 = BLM18HG102SN1D: Дроссель; Manufacturer: Murata; Max Current: 0,1 А; Article: 218909268; Type: Дроссель; Part Number: BLM18HG102SN1D; Value: 18 мГн; Package: 0603
R1 R11 R12 R20 R22 R57 R59 R68 R80-R85 R87-R89 = 0.25Вт 1206 100 кОм, 1%: Резистор; Manufacturer: Тайвань; Article: 9000079697; Type: Резистор; Part Number: 0.25Вт 1206 100 кОм, 1%; Value: 100 к; Price: 6; Package: 1206
R2 = С2-29В-0,125-20 кОм ± 0,05 %-1.0-А: Резистор; Type: Резистор; Part Number: С2-29В-0,125-20 кОм ± 0,05 %-1.0-А; Value: 20 к
R3 R5 R15 R21 = RC1206JR-070RL: Резистор; Manufacturer: Yageo; ID: 167; Limit Voltage: 200В; Tolerance: ±5%; Temperature Coefficient: 100ppm; Total Power Dissipation: 0.25W; Series Type: Thick-Film; Application Category: 1; Working Temperature Min: -55°С; Working Temperature Max: +155°С; Type: Резистор; Part Number: RC1206JR-070RL; Value: 0; Footprint: 1206
R4 = 0.25Вт 1206 30 кОм, 1%: Резистор; Manufacturer: Тайвань; Article: 9000079684; Type: Резистор; Part Number: 0.25Вт 1206 30 кОм, 1%; Value: 30 к; Price: 6; Package: 1206
R6-R9 R30-R41 R90-R92 R99 R101 R103 = 0.25Вт 1206 1 кОм, 1%: Резистор; Manufacturer: Тайвань; Article: 9000079635; Type: Резистор; Part Number: 0.25Вт 1206 1 кОм, 1%; Value: 1 к; Price: 6; Package: 1206
R10 R24 R56 R76-R79 R86 = 0.25Вт 1206 2 кОм, 5%: Резистор; Manufacturer: Тайвань; Article: 984099856; Type: Резистор; Part Number: 0.25Вт 1206 2 кОм, 5%; Value: 2 к; Price: 6; Package: 1206
R13 R14 R95 R96 = RC1206JR-07150RL: Резистор; Manufacturer: Yageo; ID: 182; Limit Voltage: 200В; Tolerance: ±5%; Temperature Coefficient: 100ppm; Total Power Dissipation: 0.25W; Series Type: Thick-Film; Application Category: 1; Working Temperature Min: -55°С; Working Temperature Max: +155°С; Type: Резистор; Part Number: RC1206JR-07150RL; Value: 150; Footprint: 1206
R16 = С2-29В-0,125-8,25 кОм ± 0,05 %-1.0-А: Резистор; Type: Резистор; Part Number: С2-29В-0,125-8,25 кОм ± 0,05 %-1.0-А; Value: 8,25 к
R17 = С2-29В-0,125-9,09 кОм ± 0,05 %-1.0-А: Резистор; Type: Резистор; Part Number: С2-29В-0,125-9,09 кОм ± 0,05 %-1.0-А; Value: 9,09 к
R18 R19 R27 R28 R42-R51 R53-R55 R58 R60-R67 R69-R75 R93 R94 R97 R98 R100 R102 R104 = 0.25Вт 1206 10 кОм, 1%: Резистор; Manufacturer: Тайвань; Article: 9000079659; Type: Резистор; Part Number: 0.25Вт 1206 10 кОм, 1%; Value: 10 к; Price: 6; Package: 1206
R23 = Р1-12-0,25-200 Ом ± 5 % - М: Резистор; Manufacturer: ОАО "Ресурс"; ID: 135; Limit Voltage: 200В; Tolerance: ±5%; Temperature Coefficient: 250ppm; Total Power Dissipation: 0,25W; Specification: ШКАБ.434110.002ТУ; Application Category: 5; Working Temperature Min: -60°С; Working Temperature Max: +85°С; Article 1C: 000495; Type: Резистор; Part Number: Р1-12-0,25-200 Ом ± 5 % - М; Value: 200; Footprint: 1206
R25 = С2-29В-0,125-100 кОм ± 0,05 %-1.0-А: Резистор; Type: Резистор; Part Number: С2-29В-0,125-100 кОм ± 0,05 %-1.0-А; Value: 100 к
R26 = Р1-12-0,25-2,2 кОм ± 5 % - М: Резистор; Manufacturer: ОАО "Ресурс"; ID: 156; Limit Voltage: 200В; Tolerance: ±5%; Temperature Coefficient: 250ppm; Total Power Dissipation: 0,25W; Specification: ШКАБ.434110.002ТУ; Application Category: 5; Working Temperature Min: -60°С; Working Temperature Max: +85°С; Type: Резистор; Part Number: Р1-12-0,25-2,2 кОм ± 5 % - М; Value: 2,2 к; Footprint: 1206; Article 1C: -
R29 = С2-29В-0,125-715 Ом ± 0,05 %-1.0-А: Резистор; Type: Резистор; Part Number: С2-29В-0,125-715 Ом ± 0,05 %-1.0-А; Value: 715
R52 = С2-29В-0,125-23 кОм ± 0,05 %-1.0-А: Резистор; Type: Резистор; Part Number: С2-29В-0,125-23 кОм ± 0,05 %-1.0-А; Value: 23 к
R105 = С2-29В-0,125-120 Ом ± 0,05 %-1.0-А_1: Резистор; Type: Резистор; Part Number: С2-29В-0,125-120 Ом ± 0,05 %-1.0-А; Value: 120
R106 R107 = 0805 4.7кОм ±5% 0.125Вт: Резистор; Manufacturer: Тайвань; Article: 8026382694; Type: Резистор; Part Number: 0805 4.7кОм ±5% 0.125Вт; Value: 4,7 к; Price: 3; Package: 0805
SB1 SB2 = KLS7-TS6601-7.0-180: Manufacturer: KLS; Article: 9000336827; Type: Переключатель; Part Number: KLS7-TS6601-7.0-180; Price: 9
VD1 VD4 = SM6T36CA: Ограничитель напряжения; Manufacturer: Sunmate; Article: 9001052836; Type: Ограничитель напряжения; Part Number: SM6T36CA; Price: 9; Package: DO214AA/SMB
VD2 VD3 VD12-VD14 = B340A: Диод Шоттки; Manufacturer: Vishay; Current: 3 A; Reverse Voltage: 40 V; Article: 9001002895; Type: Диод Шоттки; Part Number: B340A; Package: SMA; Price: 7
VD5-VD11 = BZX84-C3V3: Manufacturer: NXP; Type: Стабилитрон; ID: 10; Working Voltage: 3.3V; Reverse Current: 5uA; Forward Voltage: 0.9V; Forward Current: 200mA; Total Power Dissipation: 250mW; Capacitance: 450pF; Differential resistance: 95ohm; Application Category: 1; Working Temperature Min: -65°С; Working Temperature Max: +150°С; Article 1C: 088022; Part Number: BZX84-C3V3; Value: BZX84-C3V3
VT1-VT3 = IRFR024NTR: N-channel MOSFET; Manufacturer: UMW; Type: Транзистор; Article: 9001169193; Part Number: IRFR024NTR; Package: DPAK/TO-252; Price: 28
X1 X2 = KLS2-300-5.00-03P-2S: Соединитель; Manufacturer: KLS; Current: 16 А; Part Number: KLS2-300-5.00-03P-2S; Price: 35
X3 X4 X9 = XY301RA-5.0-3P-12: Соединитель; Manufacturer: Ningbo; Current: 16 А; Article: 53451; Part Number: XY301RA-5.0-3P-12; Price: 41
X5-X8 = KLS2-301R-5.00-02P-2S: Соединитель; Manufacturer: KLS; Current: 16 А; Article: 9000329476; Part Number: KLS2-301R-5.00-02P-2S; Price: 18
XP1 XP2 = IDC-08MR: Вилка; Manufacturer: Connfly; Article: 8841479946; Type: Вилка; Part Number: IDC-08MR; Price: 15
XS1 = PBD-40: Розетка; Part Number: DS1023-2*20S21; Manufacturer: Connfly; Article: 29417; Type: Розетка; Price: 29
XS2 = PBD-30: Розетка; Part Number: DS1023-2*15S21; Manufacturer: Connfly; Article: 26334; Type: Розетка; Price: 34
XS3 XS6 = PBS-5: Розетка; Part Number: DS1023-1*5S21; Manufacturer: Connfly; Article: 29527; Type: Розетка; Price: 9
XS4 = PBS-4: Розетка; Part Number: DS1023-1*4S21; Manufacturer: Connfly; Article: 12854; Type: Вилка; Price: 9
XS5 = PBS-8: Розетка; Part Number: DS1023-1*8S21; Manufacturer: Connfly; Article: 32562; Type: Розетка; Price: 13
XS7 XS8 = CON-6F driver: Розетка; Part Number: DS1023-1*6S21; Manufacturer: Connfly; Article: 63236; Type: Розетка; Price: 13